# Altium schematic sheet smoothieboard-5driver_1.SchDoc
size 409 x 279 mm; Date: 9/15/2017 15:08:36; Organization: Altium Limited; Address1: L3, 12a Rodborough Rd; Address2: Frenchs Forest; Address3: NSW; Address4: Australia 2086; Origin: Eagle
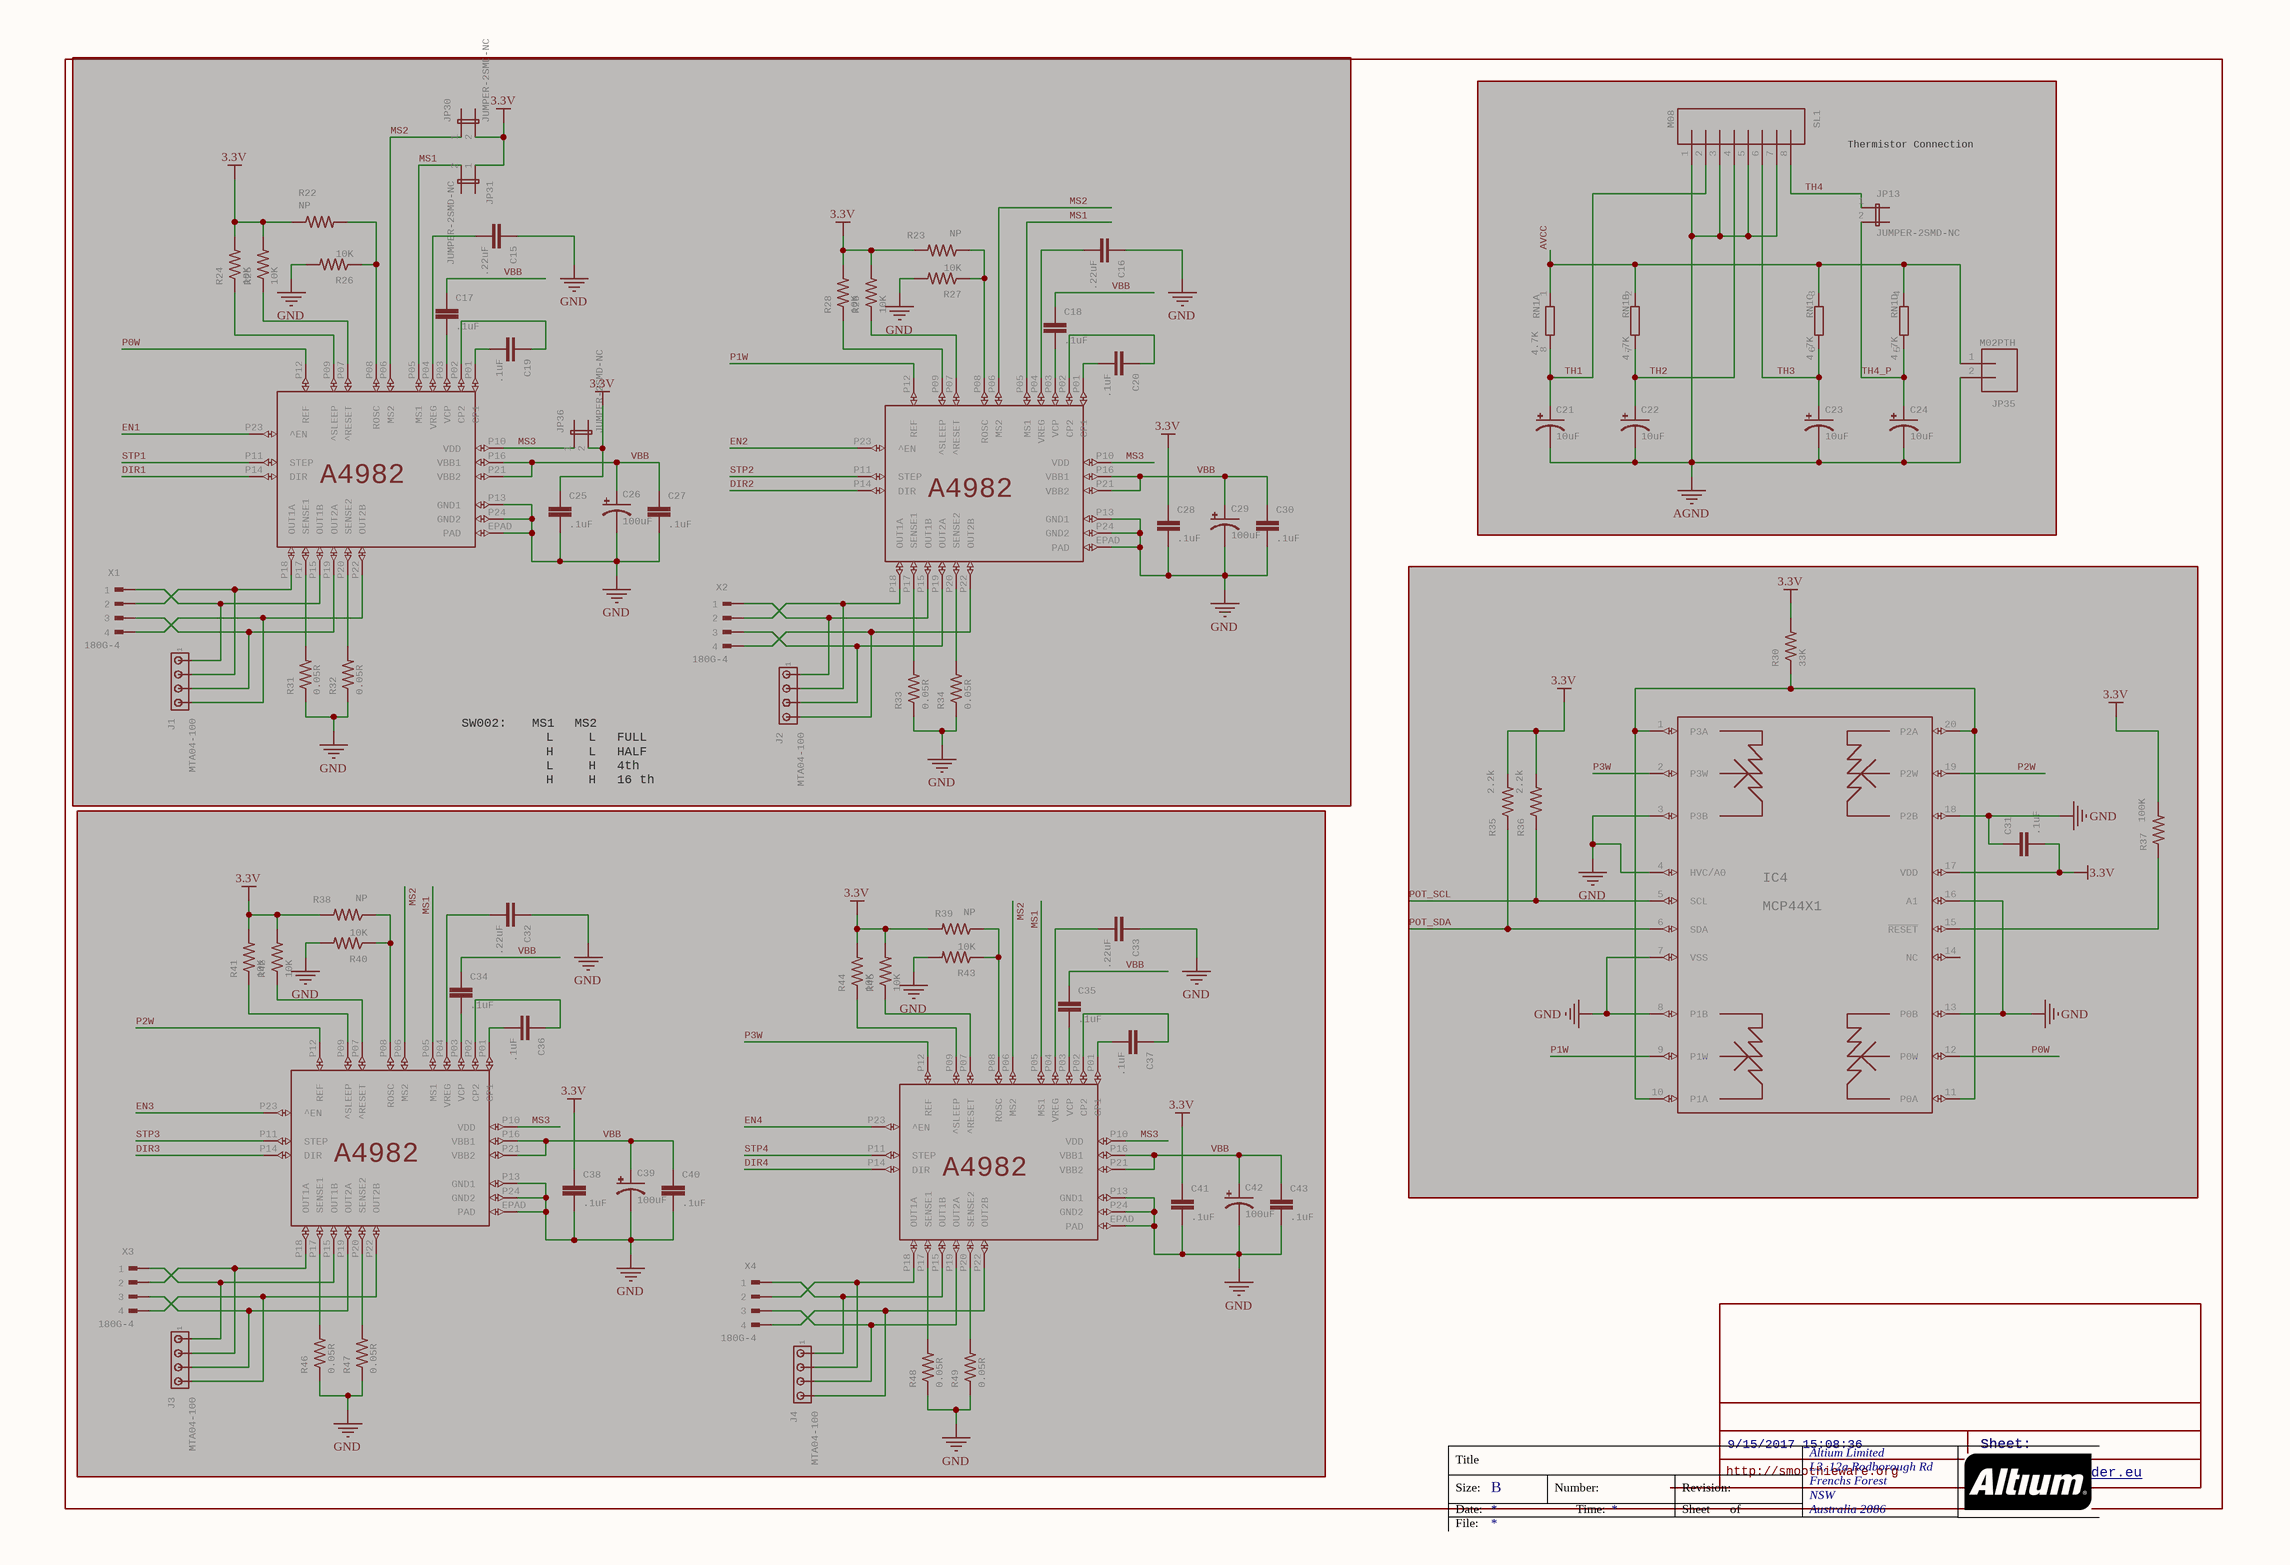
[diagram p0: smoothieboard-5driver_1.SchDoc]

## Parts
C15  .22uF  [C0603]
C16  .22uF  [C0603]
C17  .1uF  [C0603]
C18  .1uF  [C0603]
C19  .1uF  [C0603]
C20  .1uF  [C0603]
C21  10uF  [EIA3216]
C22  10uF  [EIA3216]
C23  10uF  [EIA3216]
C24  10uF  [EIA3216]
C25  .1uF  [C0603]
C26  100uF  [PANASONIC_E]
C27  .1uF  [C0603]
C28  .1uF  [C0603]
C29  100uF  [PANASONIC_E]
C30  .1uF  [C0603]
C31  .1uF  [C0603]
C32  .22uF  [C0603]
C33  .22uF  [C0603]
C34  .1uF  [C0603]
C35  .1uF  [C0603]
C36  .1uF  [C0603]
C37  .1uF  [C0603]
C38  .1uF  [C0603]
C39  100uF  [PANASONIC_E]
C40  .1uF  [C0603]
C41  .1uF  [C0603]
C42  100uF  [PANASONIC_E]
C43  .1uF  [C0603]
IC2  A5984  [ETSSOP24]  (value not drawn)
IC3  A5984  [ETSSOP24]  (value not drawn)
IC4  MCP44X1  [TSSOP20]
IC5  A5984  [ETSSOP24]  (value not drawn)
IC6  A5984  [ETSSOP24]  (value not drawn)
J1  MTA04-100  [10X04MTA]
J2  MTA04-100  [10X04MTA]
J3  MTA04-100  [10X04MTA]
J4  MTA04-100  [10X04MTA]
JP13  JUMPER-2SMD-NC  [SJ_2S]
JP30  JUMPER-2SMD-NC  [SJ_2S]
JP31  JUMPER-2SMD-NC  [SJ_2S]
JP35  M02PTH  [1X02]
JP36  JUMPER-2SMD-NC  [SJ_2S]
R22  NP  [R0603]
R23  NP  [R0603]
R24  10K  [R0603]
R25  10K  [R0603]
R26  10K  [R0603]
R27  10K  [R0603]
R28  10K  [R0603]
R29  10K  [R0603]
R30  33K  [R0603]
R31  0.05R  [R2512]
R32  0.05R  [R2512]
R33  0.05R  [R2512]
R34  0.05R  [R2512]
R35  2.2k  [R0603]
R36  2.2k  [R0603]
R37  100K  [R0603]
R38  NP  [R0603]
R39  NP  [R0603]
R40  10K  [R0603]
R41  10K  [R0603]
R42  10K  [R0603]
R43  10K  [R0603]
R44  10K  [R0603]
R45  10K  [R0603]
R46  0.05R  [R2512]
R47  0.05R  [R2512]
R48  0.05R  [R2512]
R49  0.05R  [R2512]
RN1  4.7K  [0603-ARV]  (parts A,B,C,D of 4)
SL1  M08  [08P]
X1  180G-4  [180G-4]
X2  180G-4  [180G-4]
X3  180G-4  [180G-4]
X4  180G-4  [180G-4]

## Blocks framed on the sheet
Thermistor Connection: C21-C24 JP13 JP35 RN1 SL1

## Nets
3.3V: C25.1 C28.1 C31.2 C38.1 C41.1 IC4.17(VDD) JP30.2 JP31.1 JP36.2 R22.1 R23.2 R24.2 R25.2 R28.2 R29.2 R30.2 R35.2 R36.2 R37.2 R38.2 R39.2 R41.2 R42.2 R44.2 R45.2
AGND: C21.C(-) C22.C(-) C23.C(-) C24.C(-) JP35.2 SL1.1 SL1.3 SL1.5 SL1.7
GND: C15.1 C16.1 C25.2 C26.- C27.2 C28.2 C29.- C30.2 C31.1 C32.1 C33.1 C38.2 C39.- C40.2 C41.2 C42.- C43.2 IC2.EPAD(PAD) IC2.P13(GND1) IC2.P24(GND2) IC3.EPAD(PAD) IC3.P13(GND1) IC3.P24(GND2) IC4.3(P3B) IC4.4(HVC/A0) IC4.7(VSS) IC4.8(P1B) IC4.13(P0B) IC4.16(A1) IC4.18(P2B) IC5.EPAD(PAD) IC5.P13(GND1) IC5.P24(GND2) IC6.EPAD(PAD) IC6.P13(GND1) IC6.P24(GND2) R26.2 R27.2 R31.1 R32.1 R33.1 R34.1 R40.2 R43.2 R46.1 R47.1 R48.1 R49.1
AVCC: JP35.1 RN1.1 RN1.2 RN1.3 RN1.4
DIR1: IC2.P14(DIR)
DIR2: IC3.P14(DIR)
DIR3: IC5.P14(DIR)
DIR4: IC6.P14(DIR)
EN1: IC2.P23(^EN)
EN2: IC3.P23(^EN)
EN3: IC5.P23(^EN)
EN4: IC6.P23(^EN)
MS1: IC2.P05(MS1) IC3.P05(MS1) IC5.P05(MS1) IC6.P05(MS1) JP31.2
MS2: IC2.P06(MS2) IC3.P06(MS2) IC5.P06(MS2) IC6.P06(MS2) JP30.1
MS3: IC2.P10(VDD) IC3.P10(VDD) IC5.P10(VDD) IC6.P10(VDD) JP36.1
P0W: IC2.P12(REF) IC4.12(P0W)
P1W: IC3.P12(REF) IC4.9(P1W)
P2W: IC4.19(P2W) IC5.P12(REF)
P3W: IC4.2(P3W) IC6.P12(REF)
POT_SCL: IC4.5(SCL) R36.1
POT_SDA: IC4.6(SDA) R35.1
STP1: IC2.P11(STEP)
STP2: IC3.P11(STEP)
STP3: IC5.P11(STEP)
STP4: IC6.P11(STEP)
TH1: C21.A(+) RN1.8 SL1.2
TH2: C22.A(+) RN1.7 SL1.4
TH3: C23.A(+) RN1.6 SL1.6
TH4: JP13.1 SL1.8
TH4_P: C24.A(+) JP13.2 RN1.5
VBB: C17.1 C18.1 C26.+ C27.1 C29.+ C30.1 C34.1 C35.1 C39.+ C40.1 C42.+ C43.1 IC2.P16(VBB1) IC2.P21(VBB2) IC3.P16(VBB1) IC3.P21(VBB2) IC5.P16(VBB1) IC5.P21(VBB2) IC6.P16(VBB1) IC6.P21(VBB2)
NetC15_2: C15.2 IC2.P04(VREG)
NetC16_2: C16.2 IC3.P04(VREG)
NetC17_2: C17.2 IC2.P03(VCP)
NetC18_2: C18.2 IC3.P03(VCP)
NetC19_1: C19.1 IC2.P02(CP2)
NetC19_2: C19.2 IC2.P01(CP1)
NetC20_1: C20.1 IC3.P02(CP2)
NetC20_2: C20.2 IC3.P01(CP1)
NetC32_2: C32.2 IC5.P04(VREG)
NetC33_2: C33.2 IC6.P04(VREG)
NetC34_2: C34.2 IC5.P03(VCP)
NetC35_2: C35.2 IC6.P03(VCP)
NetC36_1: C36.1 IC5.P02(CP2)
NetC36_2: C36.2 IC5.P01(CP1)
NetC37_1: C37.1 IC6.P02(CP2)
NetC37_2: C37.2 IC6.P01(CP1)
NetIC2_P07: IC2.P07(^RESET) R25.1
NetIC2_P08: IC2.P08(ROSC) R22.2 R26.1
NetIC2_P09: IC2.P09(^SLEEP) R24.1
NetIC2_P15: IC2.P15(OUT1B) J1.1 X1.1
NetIC2_P17: IC2.P17(SENSE1) R31.2
NetIC2_P18: IC2.P18(OUT1A) J1.2 X1.2
NetIC2_P19: IC2.P19(OUT2A) J1.3 X1.3
NetIC2_P20: IC2.P20(SENSE2) R32.2
NetIC2_P22: IC2.P22(OUT2B) J1.4 X1.4
NetIC3_P07: IC3.P07(^RESET) R29.1
NetIC3_P08: IC3.P08(ROSC) R23.1 R27.1
NetIC3_P09: IC3.P09(^SLEEP) R28.1
NetIC3_P15: IC3.P15(OUT1B) J2.1 X2.1
NetIC3_P17: IC3.P17(SENSE1) R33.2
NetIC3_P18: IC3.P18(OUT1A) J2.2 X2.2
NetIC3_P19: IC3.P19(OUT2A) J2.3 X2.3
NetIC3_P20: IC3.P20(SENSE2) R34.2
NetIC3_P22: IC3.P22(OUT2B) J2.4 X2.4
NetIC4_1: IC4.1(P3A) IC4.10(P1A) IC4.11(P0A) IC4.20(P2A) R30.1
NetIC4_15: IC4.15(~{RESET}) R37.1
NetIC5_P07: IC5.P07(^RESET) R42.1
NetIC5_P08: IC5.P08(ROSC) R38.1 R40.1
NetIC5_P09: IC5.P09(^SLEEP) R41.1
NetIC5_P15: IC5.P15(OUT1B) J3.1 X3.1
NetIC5_P17: IC5.P17(SENSE1) R46.2
NetIC5_P18: IC5.P18(OUT1A) J3.2 X3.2
NetIC5_P19: IC5.P19(OUT2A) J3.3 X3.3
NetIC5_P20: IC5.P20(SENSE2) R47.2
NetIC5_P22: IC5.P22(OUT2B) J3.4 X3.4
NetIC6_P07: IC6.P07(^RESET) R45.1
NetIC6_P08: IC6.P08(ROSC) R39.1 R43.1
NetIC6_P09: IC6.P09(^SLEEP) R44.1
NetIC6_P15: IC6.P15(OUT1B) J4.1 X4.1
NetIC6_P17: IC6.P17(SENSE1) R48.2
NetIC6_P18: IC6.P18(OUT1A) J4.2 X4.2
NetIC6_P19: IC6.P19(OUT2A) J4.3 X4.3
NetIC6_P20: IC6.P20(SENSE2) R49.2
NetIC6_P22: IC6.P22(OUT2B) J4.4 X4.4

Not connected (* = marked no-connect by the designer): IC4 14(NC)

## Notes on the sheet
- SW002:
- MS1
- L
- MS2
- FULL
- H
- HALF
- 4th
- 16 th
- 9/15/2017 15:08:36
- Sheet:
- http://smoothieware.org
- www.microbuilder.eu <http://www.microbuilder.eu>
- Title
- Size:
- Date:
- B
- Number:
- Time:
- Revision:
- Sheet
- of
- File:

## Library data of the parts
C15-C20 C25 C27 C28 C30-C38 C40 C41 C43 = C-EUC0603: CAPACITOR, European symbol; GateName_1: G$1; SymbolName_1: C-EU; DeviceName: C0603; LibraryName: rcl; DeviceSetName: C-EU
C21-C24 = CAP_POL1206: Capacitor PolarizedThese are standard SMD and PTH capacitors. Normally 10uF, 47uF, and 100uF in electrolytic and tantalum varieties. Always verify the external diameter of the through hole cap, it varies with capacity, voltage, and manufacturer. The EIA devices should be standard.; GateName_1: G$1; DeviceName: 1206; SymbolName_1: CAP_POL; LibraryName: SparkFun; DeviceSetName: CAP_POL
C26 C29 C39 C42 = CAP_POLE: Capacitor PolarizedThese are standard SMD and PTH capacitors. Normally 10uF, 47uF, and 100uF in electrolytic and tantalum varieties. Always verify the external diameter of the through hole cap, it varies with capacity, voltage, and manufacturer. The EIA devices should be standard.; GateName_1: G$1; DeviceName: E; SymbolName_1: CAP_POL; LibraryName: SparkFun; DeviceSetName: CAP_POL
IC2 IC3 IC5 IC6 = A4982: GateName_1: G$1; SymbolName_1: A4982; LibraryName: A4982; DeviceSetName: A4982; A4982: A4982
IC4 = MCP44X1: MCP44x1    MCP4451 -  ? Quad Resistor Network ? I2C Serial Interface Support ? Potentiometer or Rheostat Configuration Options ? Resistor Network Resolution: 7-bit ? 128 Resistors (129 Taps) 8-bit ? 256 Resistors (257 Taps); GateName_1: G$1; SymbolName_1: MCP44X1; LibraryName: Geos; DeviceSetName: MCP44X1
J1-J4 = MTA04-100: AMP connector; GateName_1: G$1; SymbolName_1: MTA-1_4; LibraryName: con-amp; DeviceSetName: MTA04-100; 1: 1
JP13 JP30 JP31 JP36 = JUMPER-2SMD-NC: JumperBasic 0.1" spaced jumper. Use with breakaway headers.; GateName_1: A; DeviceName: SMD-NC; SymbolName_1: JUMPER-2; LibraryName: SparkFun; DeviceSetName: JUMPER-2
JP35 = M02PTH: Header 2Standard 2-pin 0.1" header. Use with straight break away headers (SKU : PRT-00116), right angle break away headers (PRT-00553), swiss pins (PRT-00743), machine pins (PRT-00117), and female headers (PRT-00115). Molex polarized connector foot print use with SKU : PRT-08233 with associated crimp pins and housings.; GateName_1: G$1; SymbolName_1: M02; DeviceName: PTH; LibraryName: SparkFun; DeviceSetName: M02
R22-R30 R35-R45 = R-US_R0603: RESISTOR, American symbol; GateName_1: G$1; SymbolName_1: R-US; DeviceSetName: R-US_; DeviceName: R0603; LibraryName: resistor
R31-R34 R46-R49 = RESISTOR2512: ResistorBasic schematic elements and footprints for 0603, 1206, and PTH 1/10th watt (small) resistors.; GateName_1: G$1; DeviceName: 2512; SymbolName_1: RESISTOR; LibraryName: SparkFun; DeviceSetName: RESISTOR
RN1 = 4R-N0603-ARV: Array Chip Resistor   Source: RS Component / Phycomp; GateName_1: A; SymbolName_1: R1NV; GateName_2: B; GateName_3: C; GateName_4: D; DeviceSetName: 4R-N; SymbolName_2: R1NV; SymbolName_3: R1NV; SymbolName_4: R1NV; DeviceName: 0603-ARV; LibraryName: resistor-dil; MF: MF; MPN: MPN; OC_FARNELL: unknown; OC_NEWARK: unknown
SL1 = M08: AMP QUICK CONNECTOR; GateName_1: G$1; SymbolName_1: M08; LibraryName: con-amp-quick; DeviceSetName: M08; MF: MF; MPN: MPN; OC_FARNELL: unknown; OC_NEWARK: unknown
X1-X4 = 180G-4: WEIDMUELLER CLAMP CONNECTOR; GateName_1: G$1; SymbolName_1: MALE-4; LibraryName: con-weidmueller-sl35; DeviceSetName: 180G-4; MF: MF; MPN: MPN; OC_FARNELL: unknown; OC_NEWARK: unknown